# Altium schematic sheet LOADS.SchDoc: LOADS
size A4; DrawnBy: Lucas Church; DocumentNumber: N/A; Revision: A; SheetNumber: 4; SheetTotal: 6
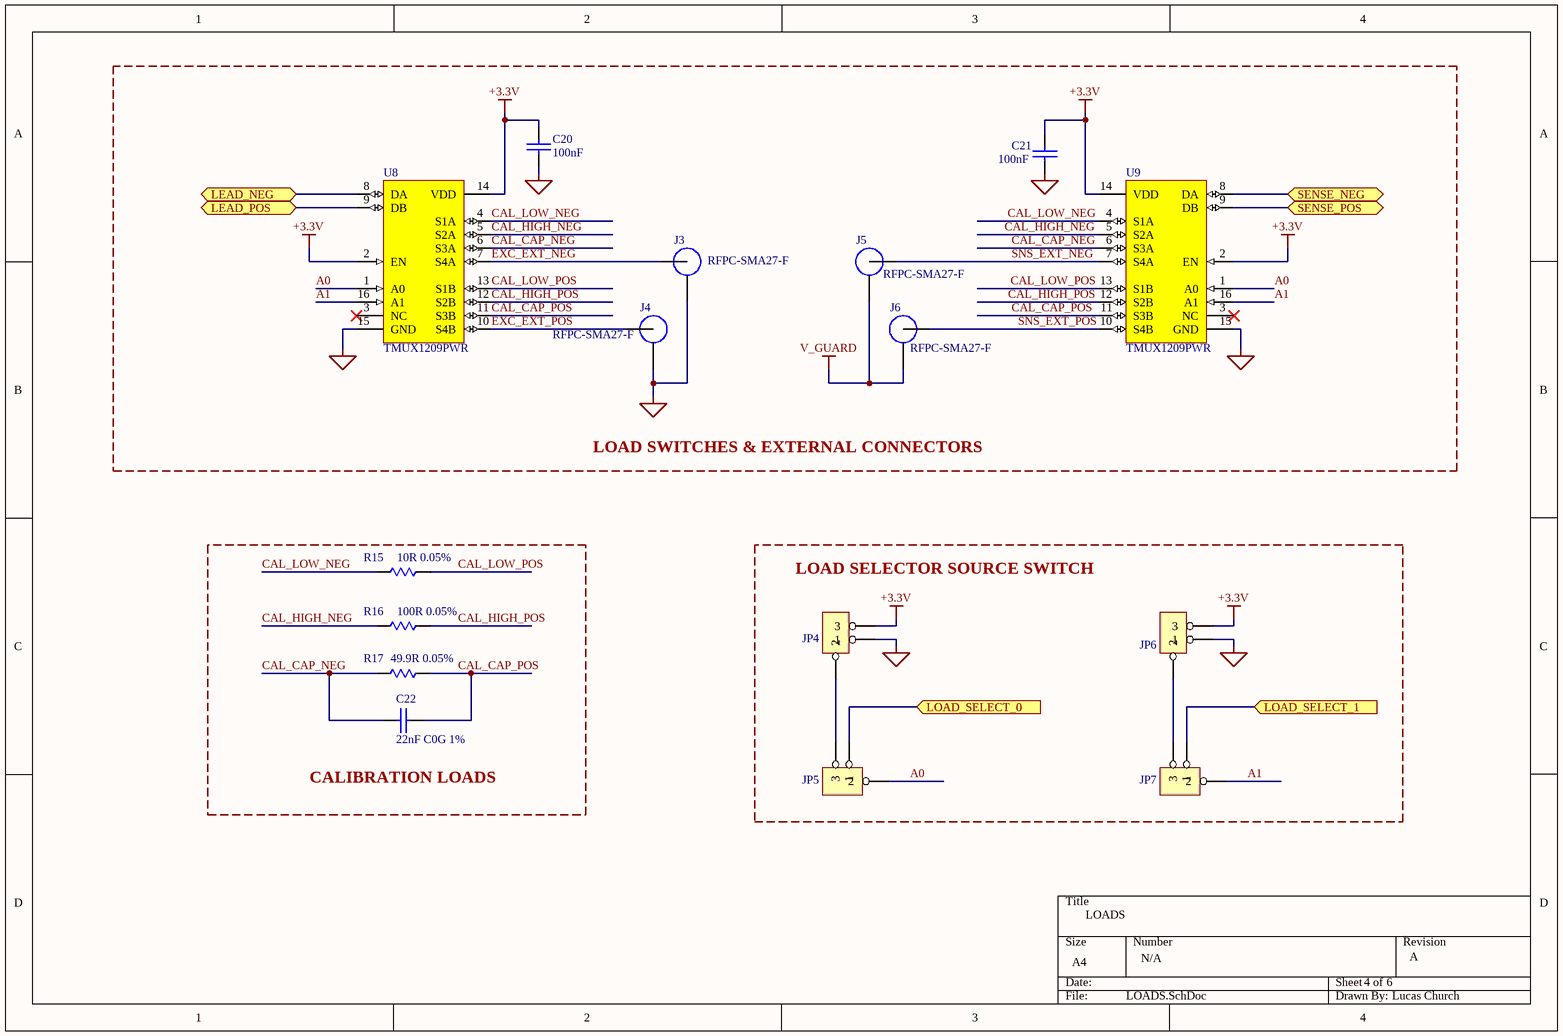
[diagram p0: LOADS.SchDoc]

## Parts
C20  100nF  [0603-CAP]
C21  100nF  [0603-CAP]
C22  22nF C0G 1%  [0805-CAP]
J3  RFPC-SMA27-F  [GRADCONN_RFPC-SMA27-F]
J4  RFPC-SMA27-F  [GRADCONN_RFPC-SMA27-F]
J5  RFPC-SMA27-F  [GRADCONN_RFPC-SMA27-F]
J6  RFPC-SMA27-F  [GRADCONN_RFPC-SMA27-F]
JP4  JUMPER1X3  [JUMPER3]  (value not drawn)
JP5  JUMPER1X3  [JUMPER3]  (value not drawn)
JP6  JUMPER1X3  [JUMPER3]  (value not drawn)
JP7  JUMPER1X3  [JUMPER3]  (value not drawn)
R15  10R 0.05%  [0603-RES]
R16  100R 0.05%  [0603-RES]
R17  49.9R 0.05%  [0603-RES]
U8  TMUX1209PWR  [PW0016A_N]
U9  TMUX1209PWR  [PW0016A_N]

## Blocks framed on the sheet
LOAD SWITCHES & EXTERNAL CONNECTORS: C20 C21 J3-J6 U8 U9
CALIBRATION LOADS: C22 R15-R17
LOAD SELECTOR SOURCE SWITCH: JP4-JP7

## Ports
LEAD_NEG (bidir, see BLOCK DIAGRAM[3C], MEHCP[4B]), LEAD_POS (bidir, see BLOCK DIAGRAM[3C], MEHCP[4C]), LOAD_SELECT_0 (in, see BLOCK DIAGRAM[3C], MCU[3A]), LOAD_SELECT_1 (in, see BLOCK DIAGRAM[3C], MCU[3A]), SENSE_NEG (bidir, see BLOCK DIAGRAM[3C], SENSE[1B]), SENSE_POS (bidir, see BLOCK DIAGRAM[3C], SENSE[1B])

## Nets
+3.3V: C20.1 C21.1 JP4.3 JP6.3 U8.2(EN) U8.14(VDD) U9.2(EN) U9.14(VDD)
GND: C20.2 C21.2 J3.SHLD J4.SHLD JP4.1 JP6.1 U8.15(GND) U9.15(GND)
V_GUARD: J5.SHLD J6.SHLD
A0: JP5.2 U8.1(A0) U9.1(A0)
A1: JP7.2 U8.16(A1) U9.16(A1)
CAL_CAP_NEG: C22.1 R17.1 U8.6(S3A) U9.6(S3A)
CAL_CAP_POS: C22.2 R17.2 U8.11(S3B) U9.11(S3B)
CAL_HIGH_NEG: R16.1 U8.5(S2A) U9.5(S2A)
CAL_HIGH_POS: R16.2 U8.12(S2B) U9.12(S2B)
CAL_LOW_NEG: R15.1 U8.4(S1A) U9.4(S1A)
CAL_LOW_POS: R15.2 U8.13(S1B) U9.13(S1B)
EXC_EXT_NEG: J3.SIG U8.7(S4A)
EXC_EXT_POS: J4.SIG U8.10(S4B)
LEAD_NEG: U8.8(DA) ; port LEAD_NEG
LEAD_POS: U8.9(DB) ; port LEAD_POS
LOAD_SELECT_0: JP5.1 ; port LOAD_SELECT_0
LOAD_SELECT_1: JP7.1 ; port LOAD_SELECT_1
SENSE_NEG: U9.8(DA) ; port SENSE_NEG
SENSE_POS: U9.9(DB) ; port SENSE_POS
SNS_EXT_NEG: J5.SIG U9.7(S4A)
SNS_EXT_POS: J6.SIG U9.10(S4B)
NetJP4_2: JP4.2 JP5.3
NetJP6_2: JP6.2 JP7.3

Not connected (* = marked no-connect by the designer): U8 3(NC)*; U9 3(NC)*

## Library data of the parts
C20 C21 = CGA3E2C0G1H472J080AA: CAP CER 100 NF 50V X7R 0603; Manufacturer Part Number 1: CC0603KRX7R9BB104; Manufacturer 1: YAGEO; Tech#: SMT; Detailed Description: CAP CER 100 NF 50V X7R 0603; Supplier 1: DigiKey; Supplier Part Number 1: 311-1344-1-ND; Supplier 2: Mouser; Supplier Part Number 2: 810-CGA3E2C0G1H472J; Price(100): 0.1434; Price(250): 0.10756
C22 = GCM21B5C1H223JA16L: CAP CER 0.022UF 50V C0G/NP0 0805; Manufacturer Part Number 1: GCM21B5C1H223FA16L; Manufacturer 1: Murata; Tech#: SMT; Detailed Description: CAP CER 0.022UF 50V C0G/NP0 0805; Supplier 1: DigiKey; Supplier Part Number 1: 490-GCM21B5C1H223FA16LCT-ND; Supplier 2: Mouser; Supplier Part Number 2: 81-GCM21B5C1H223JA6L; Price(100): 0.1789
J3-J6 = RFPC-SMA27-F: MF: {'manufacturer': u'GCT (Gradconn)'}; Package: None; Price: None; Value: *; MP: RFPC-SMA27-F; Availability: Unavailable
JP4-JP7 = 68001-203HLF: CONN HEADER VERT 36POS 2.54MM; Manufacturer 1: FCI; Detailed Description: Jumper, 1x3 Vertical T/H 0.1in; Location: #N/A; Notes: Can be 68001-236HLF cut to length; Tech#: T/H; Manufacturer Part Number 1: 68001-203HLF; Supplier 1: DigiKey; Supplier Part Number 1: 609-3470-ND; Supplier 2: Mouser; Supplier Part Number 2: 649-68001-203HLF; Price(1): 0.43; Price(10): 0.32; Price(25): 0.32; Price(100): 0.2436
R15 = 4.99K 0603: RES SMD 10OHM 0.05% 1/10W 0603; Manufacturer Part Number 1: RNCF0603AKT10R0; Manufacturer 1: Stackpole Electronics; Tech#: SMT; Detailed Description: RES SMD 10OHM 0.05% 1/10W 0603; Supplier 1: DigiKey; Supplier Part Number 1: RNCF0603AKT10R0CT-ND; Supplier 2: Mouser; Supplier Part Number 2: 754-RR0816P-4991D68H; Price(100): 0.023
R16 = 4.99K 0603: RES SMD 100OHM 0.05% 1/10W 0603; Manufacturer Part Number 1: RG1608N-101-W-T1; Manufacturer 1: Susumu; Tech#: SMT; Detailed Description: RES SMD 100OHM 0.05% 1/10W 0603; Supplier 1: DigiKey; Supplier Part Number 1: RG16N100WCT-ND; Supplier 2: Mouser; Supplier Part Number 2: 754-RR0816P-4991D68H; Price(100): 0.023
R17 = 4.99K 0603: RES SMD 49.9OHM 0.05% 1/10W 0603; Manufacturer Part Number 1: RG1608N-49R9-W-T1; Manufacturer 1: Susumu; Detailed Description: RES SMD 49.9OHM 0.1% 1/10W 0603; Tech#: SMT; Supplier 1: DigiKey; Supplier Part Number 1: 408-RG1608N-49R9-W-T1CT-ND; Supplier 2: Mouser; Supplier Part Number 2: 754-RR0816P-4991D68H; Price(100): 0.023
U8 U9 = TMUX1209PWR: 5-V, 4:1, 2-channel general-purpose multiplexer with 1.8-V input logic control 16-TSSOP -40 to 125; Manufacturer_Name: Texas Instruments; TYPE: TYPE; RefDes: RefDes; Copyright: Copyright (C) 2025 Ultra Librarian. All rights reserved.; Manufacturer_Part_Number: TMUX1209PWR